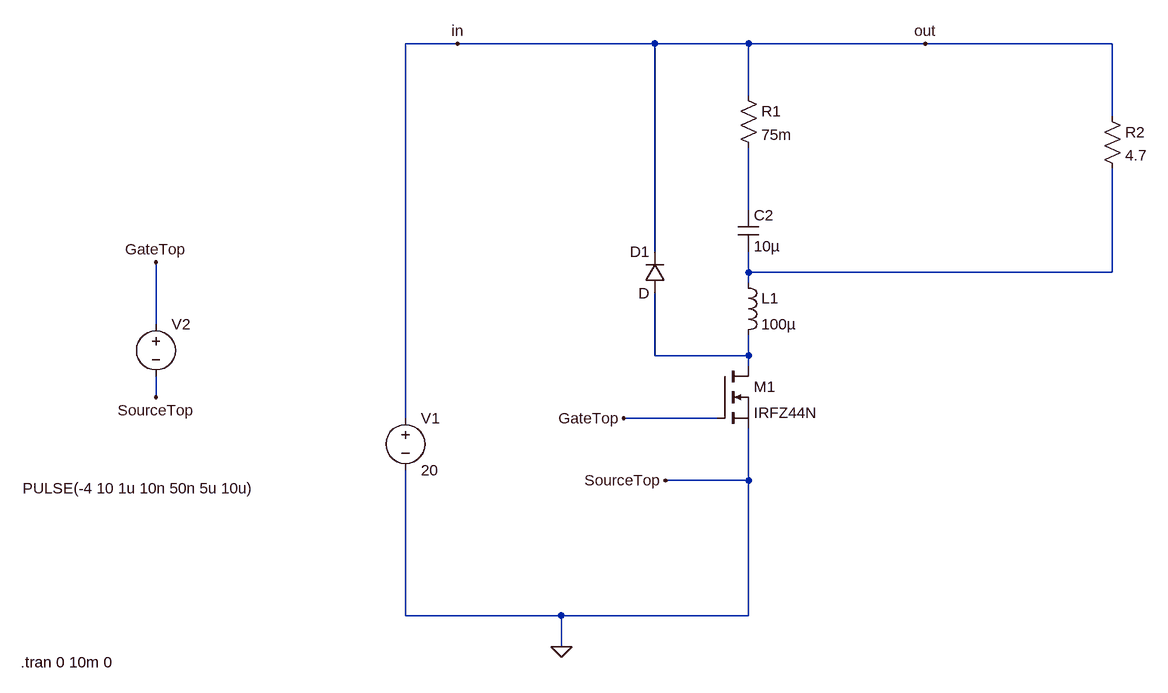
[diagram p0: schematic Buck_Lowside.asc]
Buck_Lowside.asc, the LTspice schematic file:
Version 4
SHEET 1 1684 760
WIRE -128 -384 -208 -384
WIRE 176 -384 -128 -384
WIRE 320 -384 176 -384
WIRE 592 -384 320 -384
WIRE 880 -384 592 -384
WIRE 320 -304 320 -384
WIRE 880 -272 880 -384
WIRE 320 -128 320 -224
WIRE 176 -64 176 -384
WIRE 320 -32 320 -64
WIRE 880 -32 880 -192
WIRE 880 -32 320 -32
WIRE 320 -16 320 -32
WIRE -592 48 -592 -48
WIRE 176 96 176 0
WIRE 320 96 320 64
WIRE 320 96 176 96
WIRE 320 112 320 96
WIRE -592 160 -592 128
WIRE -208 192 -208 -384
WIRE 272 192 128 192
WIRE 320 288 320 208
WIRE 320 288 192 288
WIRE -208 496 -208 272
WIRE 32 496 -208 496
WIRE 320 496 320 288
WIRE 320 496 32 496
WIRE 32 544 32 496
FLAG 128 192 GateTop
FLAG 192 288 SourceTop
FLAG -592 -48 GateTop
FLAG -592 160 SourceTop
FLAG -128 -384 in
FLAG 592 -384 out
FLAG 32 544 0
SYMBOL voltage -208 176 R0
WINDOW 123 0 0 Left 0
WINDOW 39 0 0 Left 0
SYMATTR InstName V1
SYMATTR Value 20
SYMBOL voltage -592 32 R0
WINDOW 3 -205 268 Left 2
WINDOW 123 0 0 Left 0
WINDOW 39 0 0 Left 0
SYMATTR Value PULSE(-4 10 1u 10n 50n 5u 10u)
SYMATTR InstName V2
SYMBOL res 864 -288 R0
SYMATTR InstName R2
SYMATTR Value 4.7
SYMBOL nmos 272 112 R0
SYMATTR InstName M1
SYMATTR Value IRFZ44N
SYMBOL ind 304 -32 R0
SYMATTR InstName L1
SYMATTR Value 100µ
SYMBOL diode 192 0 R180
WINDOW 0 24 64 Left 2
WINDOW 3 24 0 Left 2
SYMATTR InstName D1
SYMBOL cap 304 -128 R0
SYMATTR InstName C2
SYMATTR Value 10µ
SYMBOL res 304 -320 R0
SYMATTR InstName R1
SYMATTR Value 75m
TEXT -800 568 Left 2 !.tran 0 10m 0

The netlist it stands for:
* Buck_Lowside.asc
V1 out 0 20
V2 GateTop 0 PULSE(-4 10 1u 10n 50n 5u 10u)
R2 out N002 4.7
M1 N003 GateTop 0 0 IRFZ44N
L1 N002 N003 100µ
D1 N003 out D
C2 N001 N002 10µ
R1 out N001 75m
.model D D
.lib standard.dio
.model NMOS NMOS
.model PMOS PMOS
.lib standard.mos
.tran 0 10m 0
.backanno
.end